# Altium project Hello-Farogh-V1I0.PrjPcb (part 1 of 3)
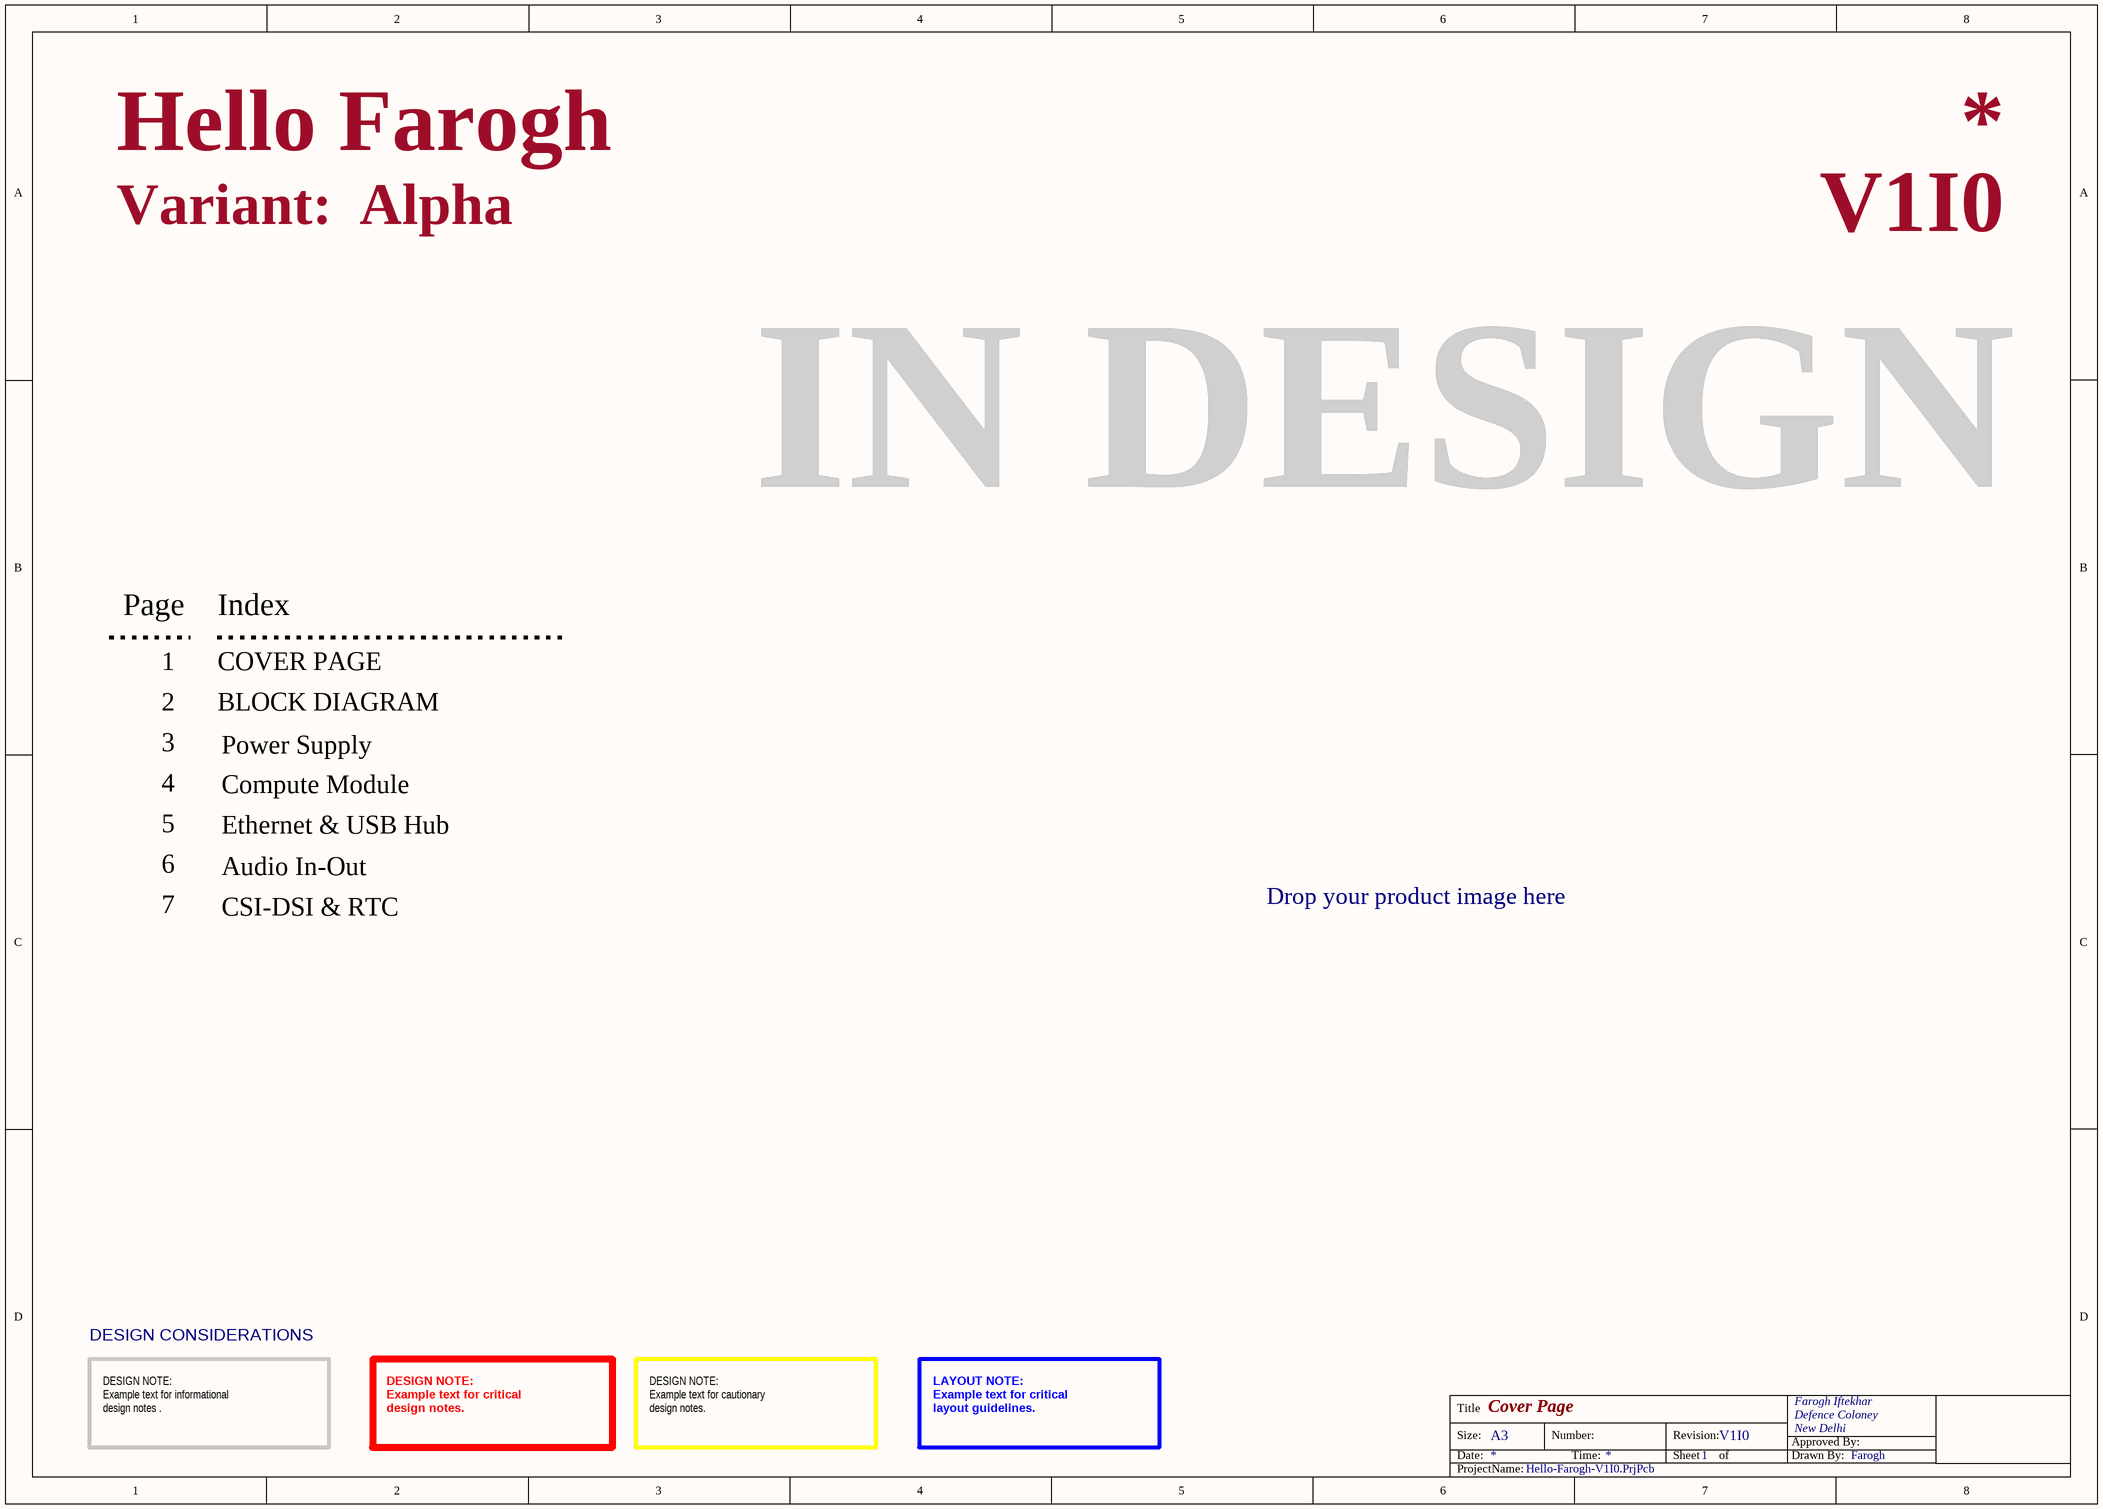
[diagram p0: [01] - Cover Page.SchDoc]
Project: Hello Farogh; Project Status 1: IN DESIGN; Project Status 2: REVIEW; Project Status 3: RELEASED; Variant: Alpha; Version: V1I0
7 sheets, 176 parts. Net scope: global (net labels, ports and power ports of the same name join across sheets).
Board file: Board.PcbDoc
Sheets:
  [01] - Cover Page.SchDoc
  [02] - Block Diagram.SchDoc
  [03] - Power Supply.SchDoc
  [04] - Compute Module.SchDoc
  [05] - Ethernet & USB Hub.SchDoc
  [06] - Audio In-Out.SchDoc
  [07] - CSI-DSI & RTC.SchDoc

## Sheet [01] - Cover Page.SchDoc: Cover Page
size A3; DrawnBy: Farogh; Organization: Farogh Iftekhar; Address1: Defence Coloney; Address2: New Delhi; Revision: V1I0; SheetNumber: 1

### Notes on the sheet
- Variant:
- Page
- Index
- 1
- 2
- COVER PAGE
- BLOCK DIAGRAM
- 3
- Power Supply
- 4
- 5
- Ethernet & USB Hub
- Compute Module
- 6
- 7
- CSI-DSI & RTC
- Audio In-Out
- Drop your product image here
- DESIGN CONSIDERATIONS
- DESIGN NOTE:
  Example text for informational
  design notes .
- DESIGN NOTE:
  Example text for critical
  design notes.
- DESIGN NOTE:
  Example text for cautionary
  design notes.
- LAYOUT NOTE:
  Example text for critical
  layout guidelines.
- Title
- Size:
- Date:
- A3
- Number:
- Time:
- Revision:
- Sheet
- of
- Approved By:
- Drawn By:
- ProjectName:

## Sheet [02] - Block Diagram.SchDoc: Block Diagram
size A3; DrawnBy: Farogh; Organization: Farogh Iftekhar; Address1: Defence Coloney; Address2: New Delhi; Revision: V1I0; SheetNumber: 2
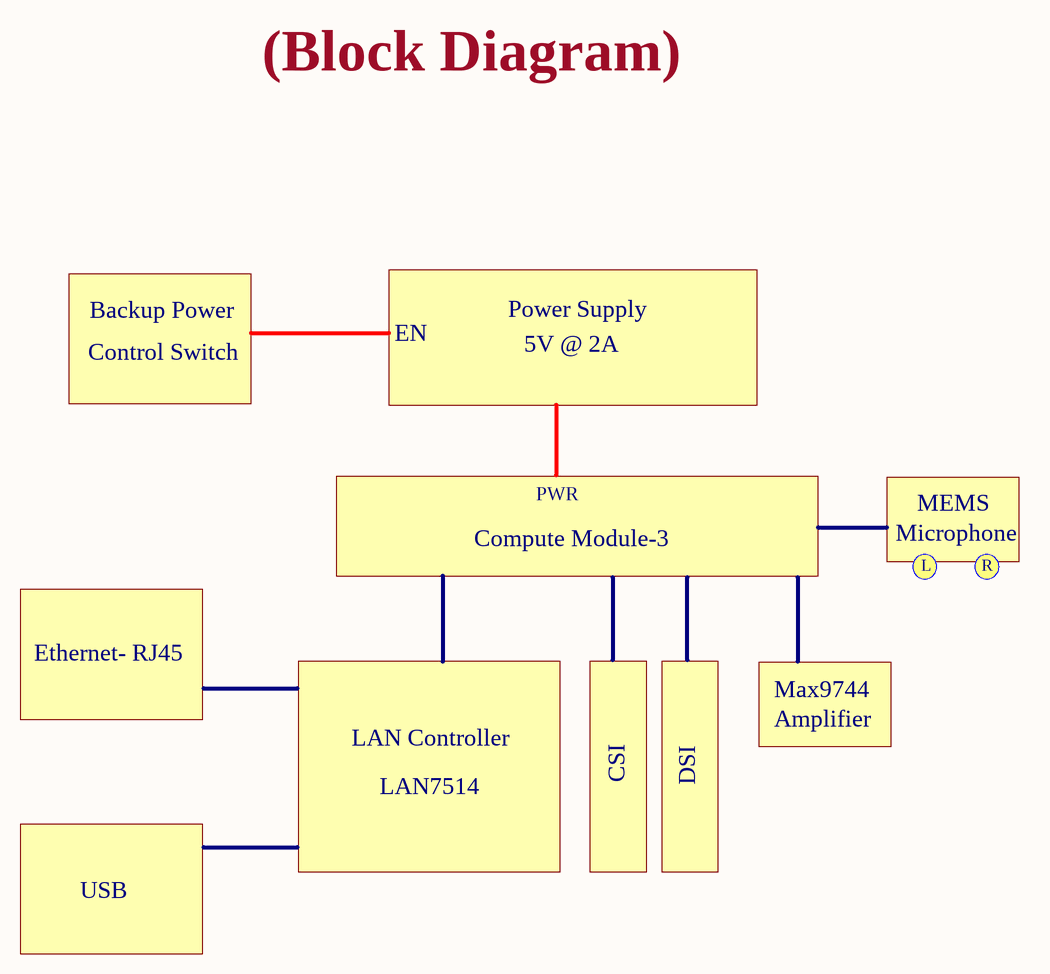
[diagram p1: [02] - Block Diagram.SchDoc]

### Notes on the sheet
- (Block Diagram)
- Backup Power
- Power Supply
- Control Switch
- EN
- 5V @ 2A
- PWR
- Microphone
- MEMS
- Compute Module-3
- L
- R
- Ethernet- RJ45
- Max9744
- Amplifier
- LAN Controller
- LAN7514
- CSI
- DSI
- USB
- Title
- Size:
- Date:
- A3
- Number:
- Time:
- Revision:
- Sheet
- of
- Approved By:
- Drawn By:
- ProjectName:

## Sheet [03] - Power Supply.SchDoc: Power Supply
size A3; DrawnBy: Farogh; Organization: Farogh Iftekhar; Address1: Defence Coloney; Address2: New Delhi; Revision: V1I0; SheetNumber: 3
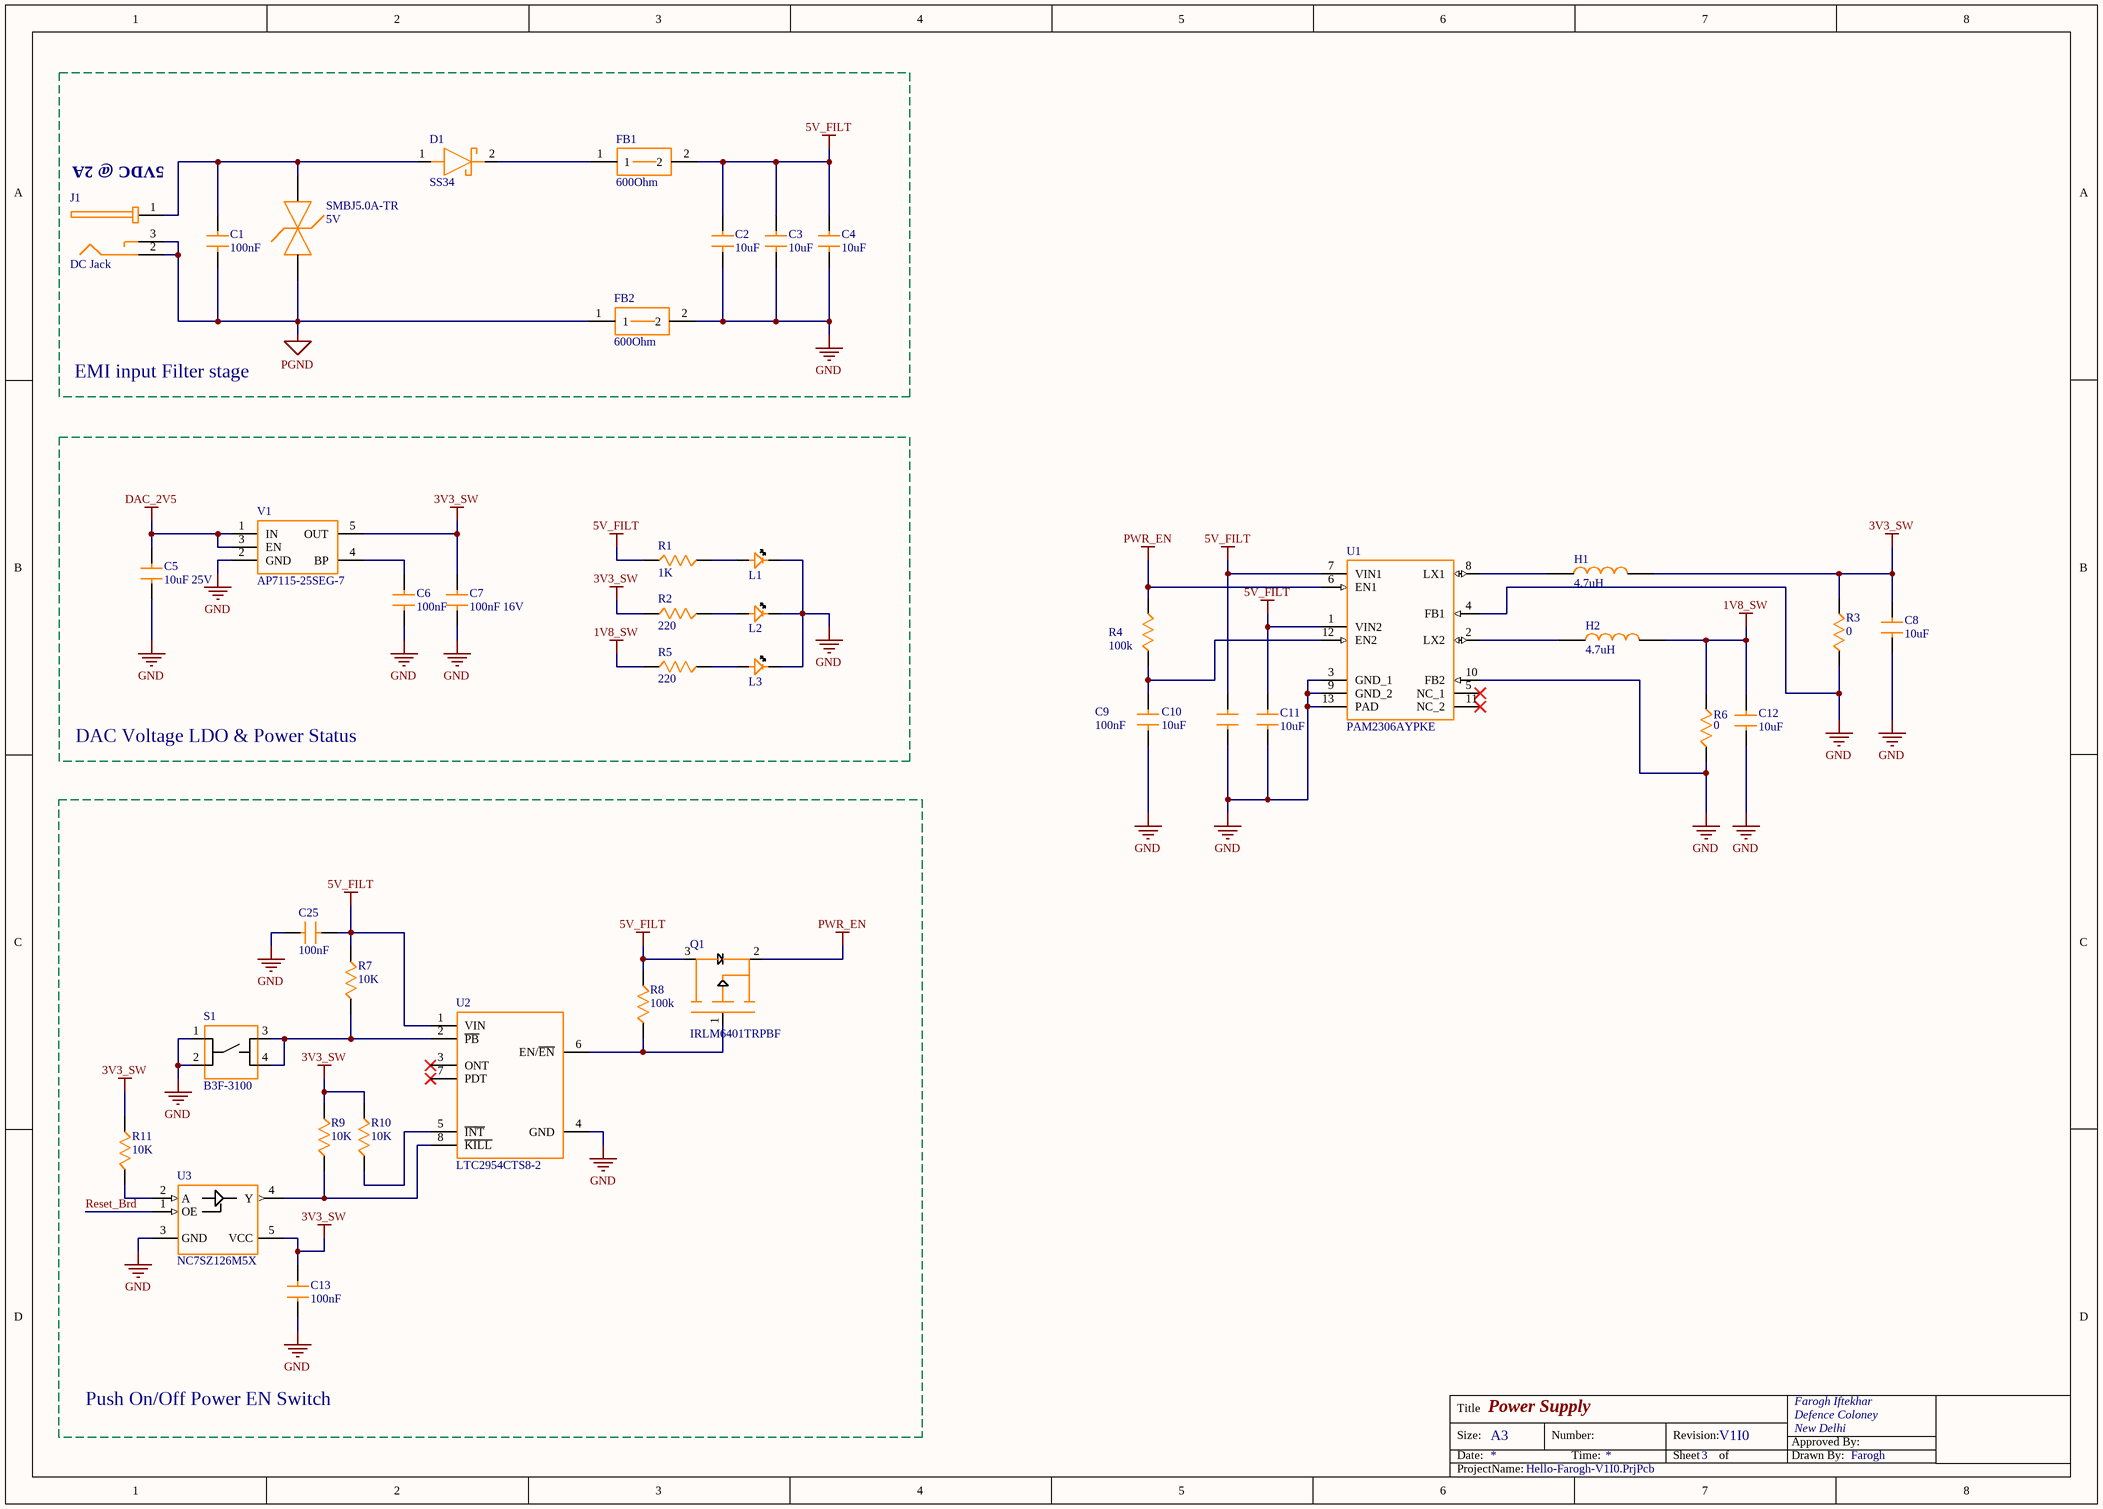
[diagram p2: [03] - Power Supply.SchDoc]

### Parts
C1  100nF  [C0805]
C2  10uF  [C1206]
C3  10uF  [C1206]
C4  10uF  [C1206]
C5  10uF 25V  [C0805]
C6  100nF  [C0805]
C7  100nF 16V  [C0805]
C8  10uF  [C0805]
C9  100nF  [C0805]
C10  10uF  [C0805]
C11  10uF  [C0805]
C12  10uF  [C0805]
C13  100nF  [C0805]
C25  100nF  [C0805]
D1  SS34  [SS34]
FB1  600Ohm  [FB_1210]
FB2  600Ohm  [FB_1210]
H1  4.7uH  [SRN4018]
H2  4.7uH  [SRN4018]
J1  DC Jack  [PJ-059BH]
L1  599-0130-007F  [LED0805]  (value not drawn)
L2  599-0130-007F  [LED0805]  (value not drawn)
L3  599-0130-007F  [LED0805]  (value not drawn)
Q1  IRLM6401TRPBF  [IRLML6401TRPBF]
R1  1K  [R0805]
R2  220  [R0805]
R3  0  [R0805]
R4  100k  [R0805]
R5  220  [R0805]
R6  0  [R0805]
R7  10K  [R0805]
R8  100k  [R0805]
R9  10K  [R0805]
R10  10K  [R0805]
R11  10K  [R0805]
S1  B3F-3100  [BSF-3100]
SMBJ5.0A-TR  5V  [SMBJ5.0A-TR]
U1  PAM2306AYPKE  [PAM2306AYPKE]
U2  LTC2954CTS8-2  [LTC2954CTS8-2]
U3  NC7SZ126M5X  [NC7SZ126M5X]
V1  AP7115-25SEG-7  [AP7115-25SEG-7]

### Blocks framed on the sheet
EMI input Filter stage: C1-C4 D1 FB1 FB2 J1 SMBJ5.0A-TR
DAC Voltage LDO & Power Status: C5-C7 L1-L3 R1 R2 R5 V1
Push On/Off Power EN Switch: C13 C25 Q1 R7-R11 S1 U2 U3

### Nets
1V8_SW: C12.2 H2.2 R5.1 R6.2
3V3_SW: C7.2 C8.2 C13.1 H1.2 R2.1 R3.2 R9.1 R10.2 R11.1 U3.5(VCC) V1.5(OUT)
5V_FILT: C2.2 C3.2 C4.2 C10.2 C11.2 C25.1 FB1.2 Q1.3(D) R1.1 R7.2 R8.2 U1.1(VIN2) U1.7(VIN1) U2.1(VIN)
DAC_2V5: C5.2 V1.1(IN) V1.3(EN)
GND: C2.1 C3.1 C4.1 C5.1 C6.1 C7.1 C8.1 C9.1 C10.1 C11.1 C12.1 C13.2 C25.2 FB2.2 L1.2 L2.2 L3.2 R3.1 R6.1 S1.1 S1.2 U1.3(GND_1) U1.4(FB1) U1.9(GND_2) U1.10(FB2) U1.13(PAD) U2.4(GND) U3.3(GND) V1.2(GND)
PGND: C1.1 FB2.1 J1.2 J1.3 SMBJ5.0A-TR.2(A)
PWR_EN: Q1.2(S) R4.2 U1.6(EN1)
Reset_Brd: U3.1(OE)
NetC1_2: C1.2 D1.1(A) J1.1 SMBJ5.0A-TR.1(K)
NetC6_2: C6.2 V1.4(BP)
NetC9_2: C9.2 R4.1 U1.12(EN2)
NetD1_2: D1.2(K) FB1.1
NetH1_1: H1.1 U1.8(LX1)
NetH2_1: H2.1 U1.2(LX2)
NetL1_1: L1.1 R1.2
NetL2_1: L2.1 R2.2
NetL3_1: L3.1 R5.2
NetQ1_1: Q1.1(G) R8.1 U2.6(EN/~{EN})
NetR7_1: R7.1 S1.3 S1.4 U2.2(~{PB})
NetR9_2: R9.2 U2.8(~{KILL}) U3.4(Y)
NetR10_1: R10.1 U2.5(~{INT})
NetR11_2: R11.2 U3.2(A)

Not connected (* = marked no-connect by the designer): U1 5(NC_1)* 11(NC_2)*; U2 3(ONT)* 7(PDT)*

### Notes on the sheet
- (near J1) 5VDC @ 2A
- Title
- Size:
- Date:
- A3
- Number:
- Time:
- Revision:
- Sheet
- of
- Approved By:
- Drawn By:
- ProjectName:

### Library data of the parts
C1 C6 C7 C9 C13 C25 = C_0805-100nF-16V: Multilayer Ceramic Capacitors MLCC - SMD/SMT 100nF 16V 20% Ceramic Capacitor; Manufacturer: Yageo; Manufacturer Part Number: CC0805MRX7R7BB104; Capacitance: 0.1 uF; Type: General Purpose and High Capacitance Surface Mount Ceramic Multilayer Capacitor; Voltage Rating DC: 16 VDC; Capacitance - pF: 100000 pF; Class: Class 2; Dielectric: X7R; Product Status: New at Mouser; Supplier 1: Mouser; Category: Multilayer Ceramic Capacitors MLCC - SMD/SMT; Stock 1: 15850; Pricing 1: 1=0.240, 10=0.114, 100=0.057, 1000=0.049, 4000=0.036, 8000=0.034, 24000=0.033, 48000=0.031, 100000=0.026 (USD); Height: 0.85 mm; Length: 2 mm; Package / Case: 0805 (2012 metric); Packaging: Cut Tape; Product: General Type MLCCs; Series: CC; Termination Style: SMD/SMT; Tolerance: 20 %; Width: 1.25 mm; Brand: Yageo; Capacitance - nF: 100 nF; Case Code - in: 0805; Case Code - mm: 2012; Maximum Operating Temperature: + 125 C; Minimum Operating Temperature: - 55 C; Product Type: Ceramic Capacitors; Standard Pack Qty: 4000; Subcategory: Capacitors; Termination: Standard; Minimum Order Quantity: 1; Reeling: True; ComponentLink1URL: https://www.mouser.com/datasheet/2/447/UPY-GPHC_X7R_6.3V-to-50V_18-1154002.pdf; ComponentLink1Description: https://www.mouser.com/datasheet/2/447/UPY-GPHC_X7R_6.3V-to-50V_18-1154002.pdf; Supplier Part Number 1: 603-CC0805MRX77BB104
C2-C4 = C_1206-10uF: Multilayer Ceramic Capacitors MLCC - SMD/SMT 10uF Y5V -20/+80% 50V; Manufacturer: Yageo; Manufacturer Part Number: CC1210ZKY5V9BB106; Tolerance: - 20 %, + 80 %; Type: MLCC Surface Mount Ceramic Capacitor; Voltage Rating DC: 50 VDC; Class: Class 2; Supplier 1: Mouser; RoHS: RoHS Compliant; Category: Multilayer Ceramic Capacitors MLCC - SMD/SMT; Stock 1: 4065; Pricing 1: 1=0.760, 10=0.524, 100=0.298, 500=0.287, 1000=0.279, 2000=0.270 (USD); Capacitance: 10 uF; Height: 1.5 mm; Length: 3.2 mm; Package / Case: 1210 (3225 metric); Packaging: Cut Tape; Product: General Type MLCCs; Series: CC; Termination Style: SMD/SMT; Width: 2.5 mm; Brand: Yageo; Case Code - in: 1210; Case Code - mm: 3225; Dielectric: Y5V; Maximum Operating Temperature: + 85 C; Minimum Operating Temperature: - 30 C; Product Type: Ceramic Capacitors; Standard Pack Qty: 2000; Subcategory: Capacitors; Termination: Standard; RoHS - Mouser: Y; Minimum Order Quantity: 1; Reeling: True; ComponentLink1URL: https://www.mouser.com/datasheet/2/447/UPY-GPHC_Y5V_6.3V-to-50V_8-1280790.pdf; ComponentLink1Description: https://www.mouser.com/datasheet/2/447/UPY-GPHC_Y5V_6.3V-to-50V_8-1280790.pdf; Supplier Part Number 1: 603-CC121ZKY5V9BB106
C5 C8 C10-C12 = C_0805-10uF: Multilayer Ceramic Capacitors MLCC - SMD/SMT 10uF 10% 25V; Manufacturer: Yageo; Manufacturer Part Number: CC0805KFX5R8BB106; Type: MLCC Surface Mount Ceramic Capacitor; Voltage Rating DC: 25 VDC; Class: Class 2; CNHTS: 8532241000; Dielectric: X5R; TARIC: 8532240000; Product Status: New Product; Supplier 1: Mouser; RoHS: RoHS Compliant; Category: Multilayer Ceramic Capacitors MLCC - SMD/SMT; Stock 1: 9112; Pricing 1: 1=0.550, 10=0.342, 100=0.175, 1000=0.158, 2500=0.110, 10000=0.106, 20000=0.103, 50000=0.096, 100000=0.089 (USD); Capacitance: 10 uF; Height: 1.25 mm; Length: 2 mm; Package / Case: 0805 (2012 metric); Packaging: Cut Tape; Product: General Type MLCCs; Series: CC; Termination Style: SMD/SMT; Tolerance: 10 %; Width: 1.25 mm; Brand: Yageo; Case Code - in: 0805; Case Code - mm: 2012; HTS Code: 8532240020; Maximum Operating Temperature: + 85 C; Minimum Operating Temperature: - 55 C; Product Type: Ceramic Capacitors; Standard Pack Qty: 10000; Subcategory: Capacitors; Termination: Standard; RoHS - Mouser: Y; Minimum Order Quantity: 1; Reeling: True; ComponentLink1URL: http://www.mouser.com/datasheet/2/447/UPY-GPHC_X5R_4V-to-50V_25-1131599.pdf; ComponentLink1Description: http://www.mouser.com/datasheet/2/447/UPY-GPHC_X5R_4V-to-50V_25-1131599.pdf; Supplier Part Number 1: 603-CC0805KFX5R8BB10
D1 = SS34: Schottky Diodes & Rectifiers 3a 40V Rectifier Schottky Barrier; Manufacturer: ON Semiconductor / Fairchild; Configuration: Single; Ifsm - Forward Surge Current: 100 A; Ir - Reverse Current: 500 uA; Vf - Forward Voltage: 0.5 V; Supplier 1: Mouser; Manufacturer Part Number: SS34; RoHS: RoHS Compliant; Category: Schottky Diodes & Rectifiers; Stock 1: 43909; Pricing 1: 1=0.610, 10=0.504, 100=0.307, 1000=0.238, 3000=0.203 (USD); Height: 2.45 mm (Max); Length: 7.15 mm (Max); Operating Temperature Range: - 55 C to + 150 C; Package / Case: SMC (DO-214AB); Packaging: Cut Tape; Product: Schottky Rectifiers; Series: SS34; Technology: Si; Type: Schottky Diode; Width: 6.25 mm (Max); Brand: ON Semiconductor / Fairchild; Mounting Style: SMD/SMT; If - Forward Current: 3 A; Maximum Operating Temperature: + 150 C; Minimum Operating Temperature: - 55 C; Product Type: Schottky Diodes & Rectifiers; Standard Pack Qty: 3000; Subcategory: Diodes & Rectifiers; Vrrm - Repetitive Reverse Voltage: 40 V; RoHS - Mouser: Y; Minimum Order Quantity: 1; Reeling: True; ComponentLink1URL: https://www.mouser.com/datasheet/2/308/SS34-1307214.pdf; ComponentLink1Description: https://www.mouser.com/datasheet/2/308/SS34-1307214.pdf; Supplier Part Number 1: 512-SS34
FB1 FB2 = FB_1210-600, 3000mA: Ferrite Beads HI CUR CHIP BD 1210 600OHMS 30%; Manufacturer: Taiyo Yuden; Manufacturer Part Number: FBMH3225HM601NT; Maximum DC Current: 3 A; Maximum DC Resistance: 42 mOhms; Type: Chip Bead Inductor for Power Lines; Test Frequency: 100 MHz; Supplier 1: Mouser; RoHS: RoHS Compliant; Category: Ferrite Beads; Stock 1: 19251; Pricing 1: 1=0.280, 10=0.178, 100=0.158, 250=0.142, 500=0.130, 1000=0.100, 2000=0.097, 5000=0.093, 10000=0.090 (USD); Capacitance: -; Height: 2.5 mm; Impedance: 600 Ohms; Length: 3.2 mm; Operating Temperature Range: - 40 C to + 125 C; Package / Case: 1210 (3225 metric); Packaging: Cut Tape; Product: Ferrite Chip Beads; Series: FB; Termination Style: SMD/SMT; Tolerance: 30 %; Width: 2.5 mm; Brand: Taiyo Yuden; Maximum Operating Temperature: + 125 C; Minimum Operating Temperature: - 40 C; Product Type: Ferrite Beads; Standard Pack Qty: 1000; Subcategory: Ferrites; RoHS - Mouser: Y; Minimum Order Quantity: 1; Reeling: True; ComponentLink1URL: https://www.mouser.com/datasheet/2/396/TaiyoYuden_chipbeads01_e-1274227.pdf; ComponentLink1Description: https://www.mouser.com/datasheet/2/396/TaiyoYuden_chipbeads01_e-1274227.pdf; Supplier Part Number 1: 963-FBMH3225HM601NT
H1 H2 = SRN4018-4R7M: Fixed Inductors 4.7uH 20% SMD 4018; Manufacturer: Bourns; Core Material: Ferrite; Maximum DC Current: 1.9 A; Maximum DC Resistance: 84 mOhms; Shielding: Shielded; CNHTS: 8504500000; MXHTS: 85045002; TARIC: 8504509590; Test Frequency: 100 kHz; Supplier 1: Mouser; Manufacturer Part Number: SRN4018-4R7M; RoHS: RoHS Compliant; Category: Fixed Inductors; Stock 1: 24604; Pricing 1: 1=0.360, 10=0.246, 100=0.224, 250=0.210, 500=0.188, 1000=0.152, 3000=0.133, 6000=0.132, 9000=0.131 (USD); Application: Power; Height: 1.8 mm; Inductance: 4.7 uH; Length: 4 mm; Packaging: Cut Tape; Product: Fixed Inductors; Series: SRN4018; Termination Style: SMD/SMT; Tolerance: 20 %; Width: 4 mm; Brand: Bourns; Mounting Style: PCB Mount; HTS Code: 8504508000; Maximum Operating Temperature: + 120 C; Minimum Operating Temperature: - 25 C; Product Type: Fixed Inductors; Standard Pack Qty: 3000; Subcategory: Inductors, Chokes & Coils; Termination: -; RoHS - Mouser: Y; Minimum Order Quantity: 1; Reeling: True; ComponentLink1URL: http://www.mouser.com/datasheet/2/54/rn4018-1391320.pdf; ComponentLink1Description: http://www.mouser.com/datasheet/2/54/rn4018-1391320.pdf; Supplier Part Number 1: 652-SRN4018-4R7M
J1 = DC-PJ-059BH: DC Power Connectors power jack, 2.5 x 5.5 mm, horizontal, through hole, high current, 1 switch; Manufacturer: CUI; Current Rating: 5 A; Inside Contact Diameter: 2.5 mm; Mounting Angle: Right Angle; Outside Contact Diameter: 5.7 mm; Voltage Rating: 24 V; Insulation Resistance: 100 MOhms; Supplier 1: Mouser; Manufacturer Part Number: PJ-059BH; RoHS: RoHS Compliant; Category: DC Power Connectors; Stock 1: 122; Pricing 1: 1=0.890, 10=0.785, 25=0.739, 50=0.708, 100=0.677, 250=0.616, 500=0.554, 1000=0.492, 2500=0.446 (USD); Color: Black; Connector Type: Jack; Contact Plating: Nickel; Housing Material: Polybutylene Terephthalate (PBT); Packaging: Tray; Product: Jacks; Termination Style: Through Hole; Brand: CUI; Contact Material: Copper; Flammability Rating: UL 94 V-0; Mounting Style: Panel; Contact Gender: Pin (Male); Maximum Operating Temperature: + 85 C; Minimum Operating Temperature: - 25 C; Product Type: DC Power Connectors; Standard Pack Qty: 280; Subcategory: Power Connectors; RoHS - Mouser: Y; Minimum Order Quantity: 1; Reeling: False; ComponentLink1URL: https://www.mouser.com/datasheet/2/670/pj-059bh-1312730.pdf; ComponentLink1Description: https://www.mouser.com/datasheet/2/670/pj-059bh-1312730.pdf
L1-L3 = 599-0130-007F: Standard LEDs - SMD SMD 0805 ORANGE; Manufacturer: Dialight; Lens Color/Style: Clear; Luminous Intensity: 95 mcd; Viewing Angle: 140 deg; CNHTS: 8541401000; If - Forward Current: 20 mA; Vf - Forward Voltage: 2.1 V; Wavelength/Color Temperature: 605 nm; Product Status: New Product; Supplier 1: Mouser; Manufacturer Part Number: 599-0130-007F; RoHS: RoHS Compliant; Category: Standard LEDs - SMD; Stock 1: 15445; Pricing 1: 1=0.450, 10=0.264, 100=0.106, 1000=0.083, 2500=0.060, 4000=0.060, 8000=0.053, 24000=0.050 (USD); Height: 0.7 mm; Illumination Color: Orange; Length: 2 mm; Orientation: Top View; Package / Case: 0805 (2012 metric); Packaging: Cut Tape; Product: Orange LEDs; Width: 1.25 mm; Brand: Dialight; Mounting Style: SMD/SMT; HTS Code: 8541402000; Maximum Operating Temperature: + 100 C; Minimum Operating Temperature: - 40 C; Product Type: LED - Standard; Standard Pack Qty: 4000; Subcategory: LEDs; RoHS - Mouser: Y; Minimum Order Quantity: 1; Reeling: True; ComponentLink1URL: http://www.mouser.com/datasheet/2/109/Dialight_CBI_data_599-0805_Apr2018-1370606.pdf; ComponentLink1Description: http://www.mouser.com/datasheet/2/109/Dialight_CBI_data_599-0805_Apr2018-1370606.pdf; Supplier Part Number 1: 645-599-0130-007F
Q1 = IRLML6401TRPBF: MOSFET MOSFT P-Ch -4.3A 50mOhm 10nC Log Lvl; Manufacturer: Infineon Technologies; Configuration: Single; Transistor Type: 1 P-Channel; Number of Channels: 1 Channel; Transistor Polarity: P-Channel; Id - Continuous Drain Current: 4.3 A; Pd - Power Dissipation: 1.3 W; Rds On - Drain-Source Resistance: 50 mOhms; Vds - Drain-Source Breakdown Voltage: 12 V; Vgs - Gate-Source Voltage: 8 V; Supplier 1: Mouser; Manufacturer Part Number: IRLML6401TRPBF; RoHS: RoHS Compliant; Category: MOSFET; Stock 1: 70377; Pricing 1: 1=0.420, 10=0.327, 100=0.178, 1000=0.133, 3000=0.115, 9000=0.108 (USD); Height: 1.1 mm; Length: 2.9 mm; Package / Case: SOT-23-3; Packaging: Cut Tape; Technology: Si; Width: 1.3 mm; Brand: Infineon Technologies; Mounting Style: SMD/SMT; Product Type: MOSFET; Qg - Gate Charge: 10 nC; Standard Pack Qty: 3000; Subcategory: MOSFETs; RoHS - Mouser: Y; Minimum Order Quantity: 1; Reeling: True; ComponentLink1URL: https://www.mouser.com/datasheet/2/196/irlml6401pbf-1228277.pdf; ComponentLink1Description: https://www.mouser.com/datasheet/2/196/irlml6401pbf-1228277.pdf; Supplier Part Number 1: 942-IRLML6401TRPBF
R1 = R_0805-1K: Thin Film Resistors - SMD 1K ohm 1% 50 ppm Thin Film; Manufacturer: Yageo; Manufacturer Part Number: RT0805FRE101KL; Power Rating: 125 mW (1/8 W); Resistance: 1 kOhms; Temperature Coefficient: 50 PPM / C; Voltage Rating: 150 V; CNHTS: 8533211000; MXHTS: 85332101; TARIC: 8533210000; Product Status: New Product; Supplier 1: Mouser; RoHS: RoHS Compliant; Category: Thin Film Resistors - SMD; Stock 1: 18694; Pricing 1: 1=0.120, 10=0.064, 100=0.023, 1000=0.016, 2500=0.011, 10000=0.010, 50000=0.009 (USD); Features: -; Height: 0.5 mm; Length: 2 mm; Package / Case: 0805 (2012 metric); Packaging: Cut Tape; Product: Precision Resistors Thin Film SMD; Series: RT; Termination Style: SMD/SMT; Tolerance: 1 %; Type: High Stability Thin Film Chip Resistor; Width: 1.25 mm; Brand: Yageo; Case Code - in: 0805; Case Code - mm: 2012; HTS Code: 8533210030; Maximum Operating Temperature: + 155 C; Minimum Operating Temperature: - 55 C; Standard Pack Qty: 10000; RoHS - Mouser: Y; Minimum Order Quantity: 1; Reeling: True; ComponentLink1URL: http://www.mouser.com/datasheet/2/447/PYu-RT_1-to-0.01_RoHS_L_9-1222720.pdf; ComponentLink1Description: http://www.mouser.com/datasheet/2/447/PYu-RT_1-to-0.01_RoHS_L_9-1222720.pdf; Supplier Part Number 1: 603-RT0805FRE101KL
R2 R5 = R_0805-220: Thin Film Resistors - SMD; Manufacturer: Yageo; Manufacturer Part Number: RT0805DRE07220RL; Power Rating: 125 mW (1/8 W); Resistance: 220 Ohms; Temperature Coefficient: 50 PPM / C; Tolerance: 0.5 %; Voltage Rating: 150 V; CNHTS: 8533211000; MXHTS: 85332101; TARIC: 8533210000; Supplier 1: Mouser; RoHS: RoHS Compliant; Category: Thin Film Resistors - SMD; Stock 1: 14351; Pricing 1: 1=0.170, 10=0.088, 100=0.031, 1000=0.022, 5000=0.015, 10000=0.014, 25000=0.013, 50000=0.012 (USD); Features: -; Height: 0.5 mm; Length: 2 mm; Operating Temperature Range: - 55 C to + 125 C; Packaging: Cut Tape; Product: Thin Film Resistors SMD; Series: RT; Technology: Thin Film; Termination Style: SMD/SMT; Type: High Precision, High Stability; Width: 1.2 mm; Brand: Yageo; Mounting Style: PCB Mount; Case Code - in: 0805; Case Code - mm: 2012; HTS Code: 8533210030; Maximum Operating Temperature: + 125 C; Minimum Operating Temperature: - 55 C; Product Type: Thin Film Resistors; Standard Pack Qty: 5000; Subcategory: Resistors; RoHS - Mouser: Y; Minimum Order Quantity: 1; Reeling: True; ComponentLink1URL: https://www.mouser.com/datasheet/2/447/PYu-RT_1-to-0.01_RoHS_L_9-1222720.pdf; ComponentLink1Description: https://www.mouser.com/datasheet/2/447/PYu-RT_1-to-0.01_RoHS_L_9-1222720.pdf; Supplier Part Number 1: 603-RT0805DRE07220RL
R3 R6 = R_0805-0: Current Sense Resistors - SMD 0 ohm Jumper 1/2W; Manufacturer: Yageo; Manufacturer Part Number: PA0805-R-470RL; Power Rating: 500 mW (1/2 W); Resistance: 0 Ohms; CNHTS: 8533211000; TARIC: 8533210000; Product Status: New Product; Supplier 1: Mouser; RoHS: RoHS Compliant; Category: Current Sense Resistors - SMD; Stock 1: 3927; Pricing 1: 1=1.30, 10=1.06, 100=0.706, 500=0.595, 1000=0.495, 5000=0.431, 10000=0.421, 25000=0.409 (USD); Application: Current Sense; Length: 2.03 mm; Packaging: Cut Tape; Product: Current Sense Chip Resistor Surface Mount; Series: PA_L; Technology: Metal Element; Termination Style: SMD/SMT; Tolerance: -; Type: Low TCR Current Sense Resistor; Width: 1.27 mm; Brand: Yageo; Mounting Style: PCB Mount; Case Code - in: 0805; Case Code - mm: 2012; HTS Code: 8533210030; Maximum Operating Temperature: + 155 C; Minimum Operating Temperature: - 55 C; Product Type: Current Sense Resistors; Standard Pack Qty: 5000; Subcategory: Resistors; Termination: 2 Terminal; RoHS - Mouser: Y; Minimum Order Quantity: 1; Reeling: True; ComponentLink1URL: http://www.mouser.com/datasheet/2/447/PYu-PA0805_L_51_RoHS_0-1480254.pdf; ComponentLink1Description: http://www.mouser.com/datasheet/2/447/PYu-PA0805_L_51_RoHS_0-1480254.pdf; Supplier Part Number 1: 603-PA0805-R-470RL
R4 R8 = R_0805-100K: Thick Film Resistors - SMD 100K ohm 1% 150V AEC-Q200; Manufacturer: Yageo; Manufacturer Part Number: AC0805FR-13100KL; Power Rating: 125 mW (1/8 W); Resistance: 100 kOhms; Temperature Coefficient: 100 PPM / C; Product Status: New Product; Supplier 1: Mouser; Category: Thick Film Resistors - SMD; Stock 1: 38013; Pricing 1: 1=0.160, 10=0.037, 100=0.013, 1000=0.010, 2500=0.006, 20000=0.005 (USD); Application: Automotive Grade; Features: -; Height: 0.5 mm; Length: 2 mm; Package / Case: 0805 (2012 metric); Packaging: Cut Tape; Product: Thick Film Resistors SMD; Series: AC; Technology: Thick Film; Termination Style: SMD/SMT; Tolerance: 1 %; Voltage Rating: 150 V; Width: 1.25 mm; Brand: Yageo; Mounting Style: PCB Mount; Case Code - in: 0805; Case Code - mm: 2012; HTS Code: 8533210030; Maximum Operating Temperature: + 155 C; Minimum Operating Temperature: - 55 C; Product Type: Thick Film Resistors; Standard Pack Qty: 20000; Subcategory: Resistors; Minimum Order Quantity: 1; Reeling: True; ComponentLink1URL: http://www.mouser.com/datasheet/2/447/PYu-AC_51_RoHS_L_6-1152827.pdf; ComponentLink1Description: http://www.mouser.com/datasheet/2/447/PYu-AC_51_RoHS_L_6-1152827.pdf; Supplier Part Number 1: 603-AC0805FR-13100KL
R7 R9-R11 = R_0805-10K: Thick Film Resistors - SMD 10K   OHM   1% 1/4W; Manufacturer: Yageo; Manufacturer Part Number: RC0805FR-7W10KL; Power Rating: 125 mW, 250 mW; Resistance: 10 kOhms; Temperature Coefficient: 100 PPM / C; Voltage Rating: 150 V; CNHTS: 8533211000; MXHTS: 85332101; TARIC: 8533210000; Supplier 1: Mouser; RoHS: RoHS Compliant; Category: Thick Film Resistors - SMD; Stock 1: 8240; Pricing 1: 1=0.190, 10=0.115, 100=0.038, 1000=0.026, 5000=0.020, 10000=0.019, 25000=0.018, 100000=0.017 (USD); Application: High Reliability; Features: -; Height: 0.5 mm; Length: 2 mm; Package / Case: 0805 (2012 metric); Packaging: Cut Tape; Product: Thick Film Resistors SMD; Series: RC; Technology: Thick Film; Termination Style: SMD/SMT; Tolerance: 1 %; Type: High Power; Width: 1.25 mm; Brand: Yageo; Mounting Style: PCB Mount; Case Code - in: 0805; Case Code - mm: 2012; HTS Code: 8533210030; Maximum Operating Temperature: + 155 C; Minimum Operating Temperature: - 55 C; Product Type: Thick Film Resistors; Standard Pack Qty: 5000; Subcategory: Resistors; RoHS - Mouser: Y; Minimum Order Quantity: 1; Reeling: True; ComponentLink1URL: http://www.mouser.com/datasheet/2/447/yageo_01152019_DESIGN_KITS_8_2012-1522572.pdf; ComponentLink1Description: http://www.mouser.com/datasheet/2/447/yageo_01152019_DESIGN_KITS_8_2012-1522572.pdf; Supplier Part Number 1: 603-RC0805FR-7W10KL
S1 = B3F-3100: Tactile Switches 3.15mm VERT 100gF; Manufacturer: Omron Electronics; Actuator: Round; Contact Form: SPST; Current Rating: 50 mA; Operating Force: 1 N; Voltage Rating DC: 24 VDC; Ground Terminal: Yes; Illuminated: Non-Illuminated; Mounting Direction: Right Angle; CNHTS: 8536500000; MXHTS: 85365099; Supplier 1: Mouser; Manufacturer Part Number: B3F-3100; RoHS: RoHS Compliant; Category: Tactile Switches; Stock 1: 5962; Pricing 1: 1=0.470, 10=0.452, 25=0.444, 50=0.427, 100=0.369, 250=0.335, 500=0.319, 1000=0.252, 2500=0.235 (USD); Color: Gray; Contact Plating: Gold; Height: 7.4 mm; Illumination Color: -; Length: 6.25 mm; Series: B3F; Stem Height: 3.15 mm; Termination Style: Solder Pin; Voltage Rating AC: -; Width: 7.3 mm; Brand: Omron Electronics; Lamp Type: -; Mounting Style: Through Hole; HTS Code: 8536509065; Maximum Operating Temperature: + 70 C; Minimum Operating Temperature: - 25 C; Product Type: Tactile Switches; Standard Pack Qty: 1000; Subcategory: Switches; RoHS - Mouser: Y; Minimum Order Quantity: 1; Reeling: False; ComponentLink1URL: http://www.mouser.com/datasheet/2/307/en-b3f-13826.pdf; ComponentLink1Description: http://www.mouser.com/datasheet/2/307/en-b3f-13826.pdf; Supplier Part Number 1: 653-B3F-3100
SMBJ5.0A-TR = SMBJ5.0A-TR: ESD Suppressors / TVS Diodes 600W 5.0V Unidirect; Manufacturer: STMicroelectronics; Breakdown Voltage: 6.4 V to 7.07 V; Clamping Voltage: 13.4 V; Polarity: Unidirectional; Supplier 1: Mouser; Manufacturer Part Number: SMBJ5.0A-TR; RoHS: RoHS Compliant; Category: ESD Suppressors / TVS Diodes; Stock 1: 38599; Pricing 1: 1=0.360, 10=0.268, 100=0.146, 1000=0.109, 2500=0.094, 10000=0.088, 25000=0.081, 50000=0.078, 100000=0.075 (USD); Package / Case: DO-214AA-2 (SMB); Packaging: Cut Tape; Series: SMBJ; Termination Style: SMD/SMT; Brand: STMicroelectronics; Maximum Operating Temperature: + 175 C; Minimum Operating Temperature: - 65 C; Pd - Power Dissipation: 600 W; Product Type: TVS Diodes; Standard Pack Qty: 2500; Subcategory: TVS Diodes / ESD Suppression Diodes; Tradename: Transil; Vesd - Voltage ESD Air Gap: -; Vesd - Voltage ESD Contact: -; Working Voltage: 5 V; RoHS - Mouser: Y; Minimum Order Quantity: 1; Reeling: True; ComponentLink1URL: https://www.mouser.com/datasheet/2/389/smbj-955195.pdf; ComponentLink1Description: https://www.mouser.com/datasheet/2/389/smbj-955195.pdf; Supplier Part Number 1: 511-SMBJ5.0A
U1 = PAM2306AYPKE: Switching Voltage Regulators Dual PWM Step-Down 40uA 1A 1.5MHz; Manufacturer: Diodes Incorporated; Input Voltage: 2.5 V to 5.5 V; Input Voltage MAX: 5.5 V; Number of Outputs: 2 Output; Output Voltage: 1.8 V, 3.3 V; Topology: Buck; Input Voltage MIN: 2.5 V; Load Regulation: 0.5 %; Supplier 1: Mouser; Manufacturer Part Number: PAM2306AYPKE; RoHS: RoHS Compliant; Category: Switching Voltage Regulators; Stock 1: 14729; Pricing 1: 1=0.700, 10=0.589, 100=0.380, 1000=0.304, 3000=0.304 (USD); Operating Temperature Range: - 40 C to + 85 C; Output Current: 1 A; Package / Case: WDFN-EP-12; Packaging: Cut Tape; Series: PAM2306; Type: PWM Step-Down DC-DC Converter; Brand: Diodes Incorporated; Mounting Style: SMD/SMT; Shutdown: Shutdown; Switching Frequency: 1.5 MHz; Maximum Operating Temperature: + 85 C; Minimum Operating Temperature: - 40 C; Operating Supply Current: 40 uA; Product Type: Switching Voltage Regulators; Standard Pack Qty: 3000; Subcategory: PMIC - Power Management ICs; Supply Voltage - Min: 2.5 V; Tradename: PAM2306; RoHS - Mouser: Y; Minimum Order Quantity: 1; Reeling: True; ComponentLink1URL: https://www.mouser.com/datasheet/2/115/PAM2306-336770.pdf; ComponentLink1Description: https://www.mouser.com/datasheet/2/115/PAM2306-336770.pdf; Supplier Part Number 1: 621-PAM2306AYPKE
U2 = LTC2954CTS8-2: Supervisory Circuits Push Button On/Off Controller with U Interrupt for Menu Driven Applications; Manufacturer: Analog Devices; Manufacturer Part Number: LTC2954CTS8-2#TRMPBF; Output Type: Open Drain; Quiescent Current: 6 uA; Battery Backup Switching: No Backup; Chip Enable Signals: Chip Enable; Development Kit: DC1090A; Number of Inputs Monitored: 1 Input; Operating Supply Current: 0.006 mA; Power Fail Detection: Yes; Reset Delay Time: 43.5 ms; Supply Voltage - Max: 26.4 V; Supply Voltage - Min: 2.7 V; Threshold Voltage: 600 mV; Watchdog Timers: No Watchdog; Product Status: New at Mouser; Supplier 1: Mouser; RoHS: RoHS Compliant; Category: Supervisory Circuits; Stock 1: 998; Pricing 1: 1=4.56, 25=3.03, 100=2.50, 250=2.37, 500=2.17, 1500=2.11 (USD); Package / Case: SOT-8; Packaging: Cut Tape; Series: LTC2954; Type: Voltage Supervisory; Brand: Analog Devices; Manual Reset: Manual Reset; Mounting Style: SMD/SMT; Maximum Operating Temperature: + 70 C; Minimum Operating Temperature: 0 C; Product Type: Supervisory Circuits; Standard Pack Qty: 500; Subcategory: PMIC - Power Management ICs; RoHS - Mouser: Y; Minimum Order Quantity: 1; Reeling: True; ComponentLink1URL: https://www.mouser.com/datasheet/2/609/2954fb-1267553.pdf; ComponentLink1Description: https://www.mouser.com/datasheet/2/609/2954fb-1267553.pdf; Supplier Part Number 1: 584-C2954CTS8-2TMPF
U3 = NC7SZ126M5X: Buffers & Line Drivers UHS Buffer; Manufacturer: ON Semiconductor / Fairchild; Function: Buffer/Line Driver; Output Type: 3-State; Quiescent Current: 2 uA; Logic Family: TinyLogic UHS; Logic Type: CMOS; Number of Channels: 1 Channel; Number of Input Lines: 1 Input; Number of Output Lines: 1 Output; High Level Output Current: - 32 mA; Input Signal Type: Single-Ended; Low Level Output Current: 32 mA; Operating Supply Voltage: 1.65 V to 5.5 V; Pd - Power Dissipation: 200 mW; Polarity: Non-Inverting; Propagation Delay Time: 5.7 ns at 3.3 V, 5 ns at 5 V; Supply Voltage - Max: 5.5 V; Supply Voltage - Min: 1.65 V; Supplier 1: Mouser; Manufacturer Part Number: NC7SZ126M5X; RoHS: RoHS Compliant; Category: Buffers & Line Drivers; Stock 1: 19641; Pricing 1: 1=0.490, 10=0.314, 100=0.135, 1000=0.104, 3000=0.079, 9000=0.070, 24000=0.066 (USD); Height: 1.3 mm (Max); Length: 3 mm (Max); Package / Case: SOT-23-5; Packaging: Cut Tape; Series: NC7SZ126; Technology: CMOS; Width: 1.7 mm (Max); Brand: ON Semiconductor / Fairchild; Mounting Style: SMD/SMT; Supply Current - Max: 2 uA; Maximum Operating Temperature: + 85 C; Minimum Operating Temperature: - 40 C; Product Type: Buffers & Line Drivers; Standard Pack Qty: 3000; Subcategory: Logic ICs; Tradename: TinyLogic; RoHS - Mouser: Y; Minimum Order Quantity: 1; Reeling: True; ComponentLink1URL: https://www.mouser.com/datasheet/2/308/NC7SZ126-1301534.pdf; ComponentLink1Description: https://www.mouser.com/datasheet/2/308/NC7SZ126-1301534.pdf; Supplier Part Number 1: 512-NC7SZ126M5X
V1 = AP7115-25SEG-7: LDO Voltage Regulators LDO SNGLE OUTPUT 150MA 220MV 2.5-5.5V; Manufacturer: Diodes Incorporated; Input Voltage MAX: 5.5 V; Number of Outputs: 1 Output; Output Type: Fixed; Output Voltage: 2.5 V; Dropout Voltage - Max: 200 mV; PSRR / Ripple Rejection - Typ: 70 dB; Voltage Regulation Accuracy: 2 %; Ib - Input Bias Current: 80 uA; Line Regulation: 0.1 %/V; Load Regulation: 0.003 %/mA; Pd - Power Dissipation: 500 mW (1/2 W); Supplier 1: Mouser; Manufacturer Part Number: AP7115-25SEG-7; RoHS: RoHS Compliant; Category: LDO Voltage Regulators; Stock 1: 7418; Pricing 1: 1=0.380, 10=0.288, 100=0.156, 1000=0.117, 3000=0.101, 9000=0.095 (USD); Height: 1.1 mm; Length: 3 mm; Operating Temperature Range: - 40 C to + 85 C; Output Current: 150 mA; Package / Case: SOT-353-5; Packaging: Cut Tape; Product: LDO Regulators; Series: AP7115; Width: 1.6 mm; Brand: Diodes Incorporated; Mounting Style: SMD/SMT; Input Voltage MIN: 2.5 V; Maximum Operating Temperature: + 85 C; Minimum Operating Temperature: - 40 C; Product Type: LDO Voltage Regulators; Standard Pack Qty: 3000; Subcategory: PMIC - Power Management ICs; RoHS - Mouser: Y; Minimum Order Quantity: 1; Reeling: True; ComponentLink1URL: https://www.mouser.com/datasheet/2/115/AP7115-69794.pdf; ComponentLink1Description: https://www.mouser.com/datasheet/2/115/AP7115-69794.pdf; Supplier Part Number 1: 621-AP7115-25SEG-7

## Sheet [04] - Compute Module.SchDoc: Compte Module & SD Card
size A3; DrawnBy: Farogh; Organization: Farogh Iftekhar; Address1: Defence Coloney; Address2: New Delhi; Revision: V1I0; SheetNumber: 4
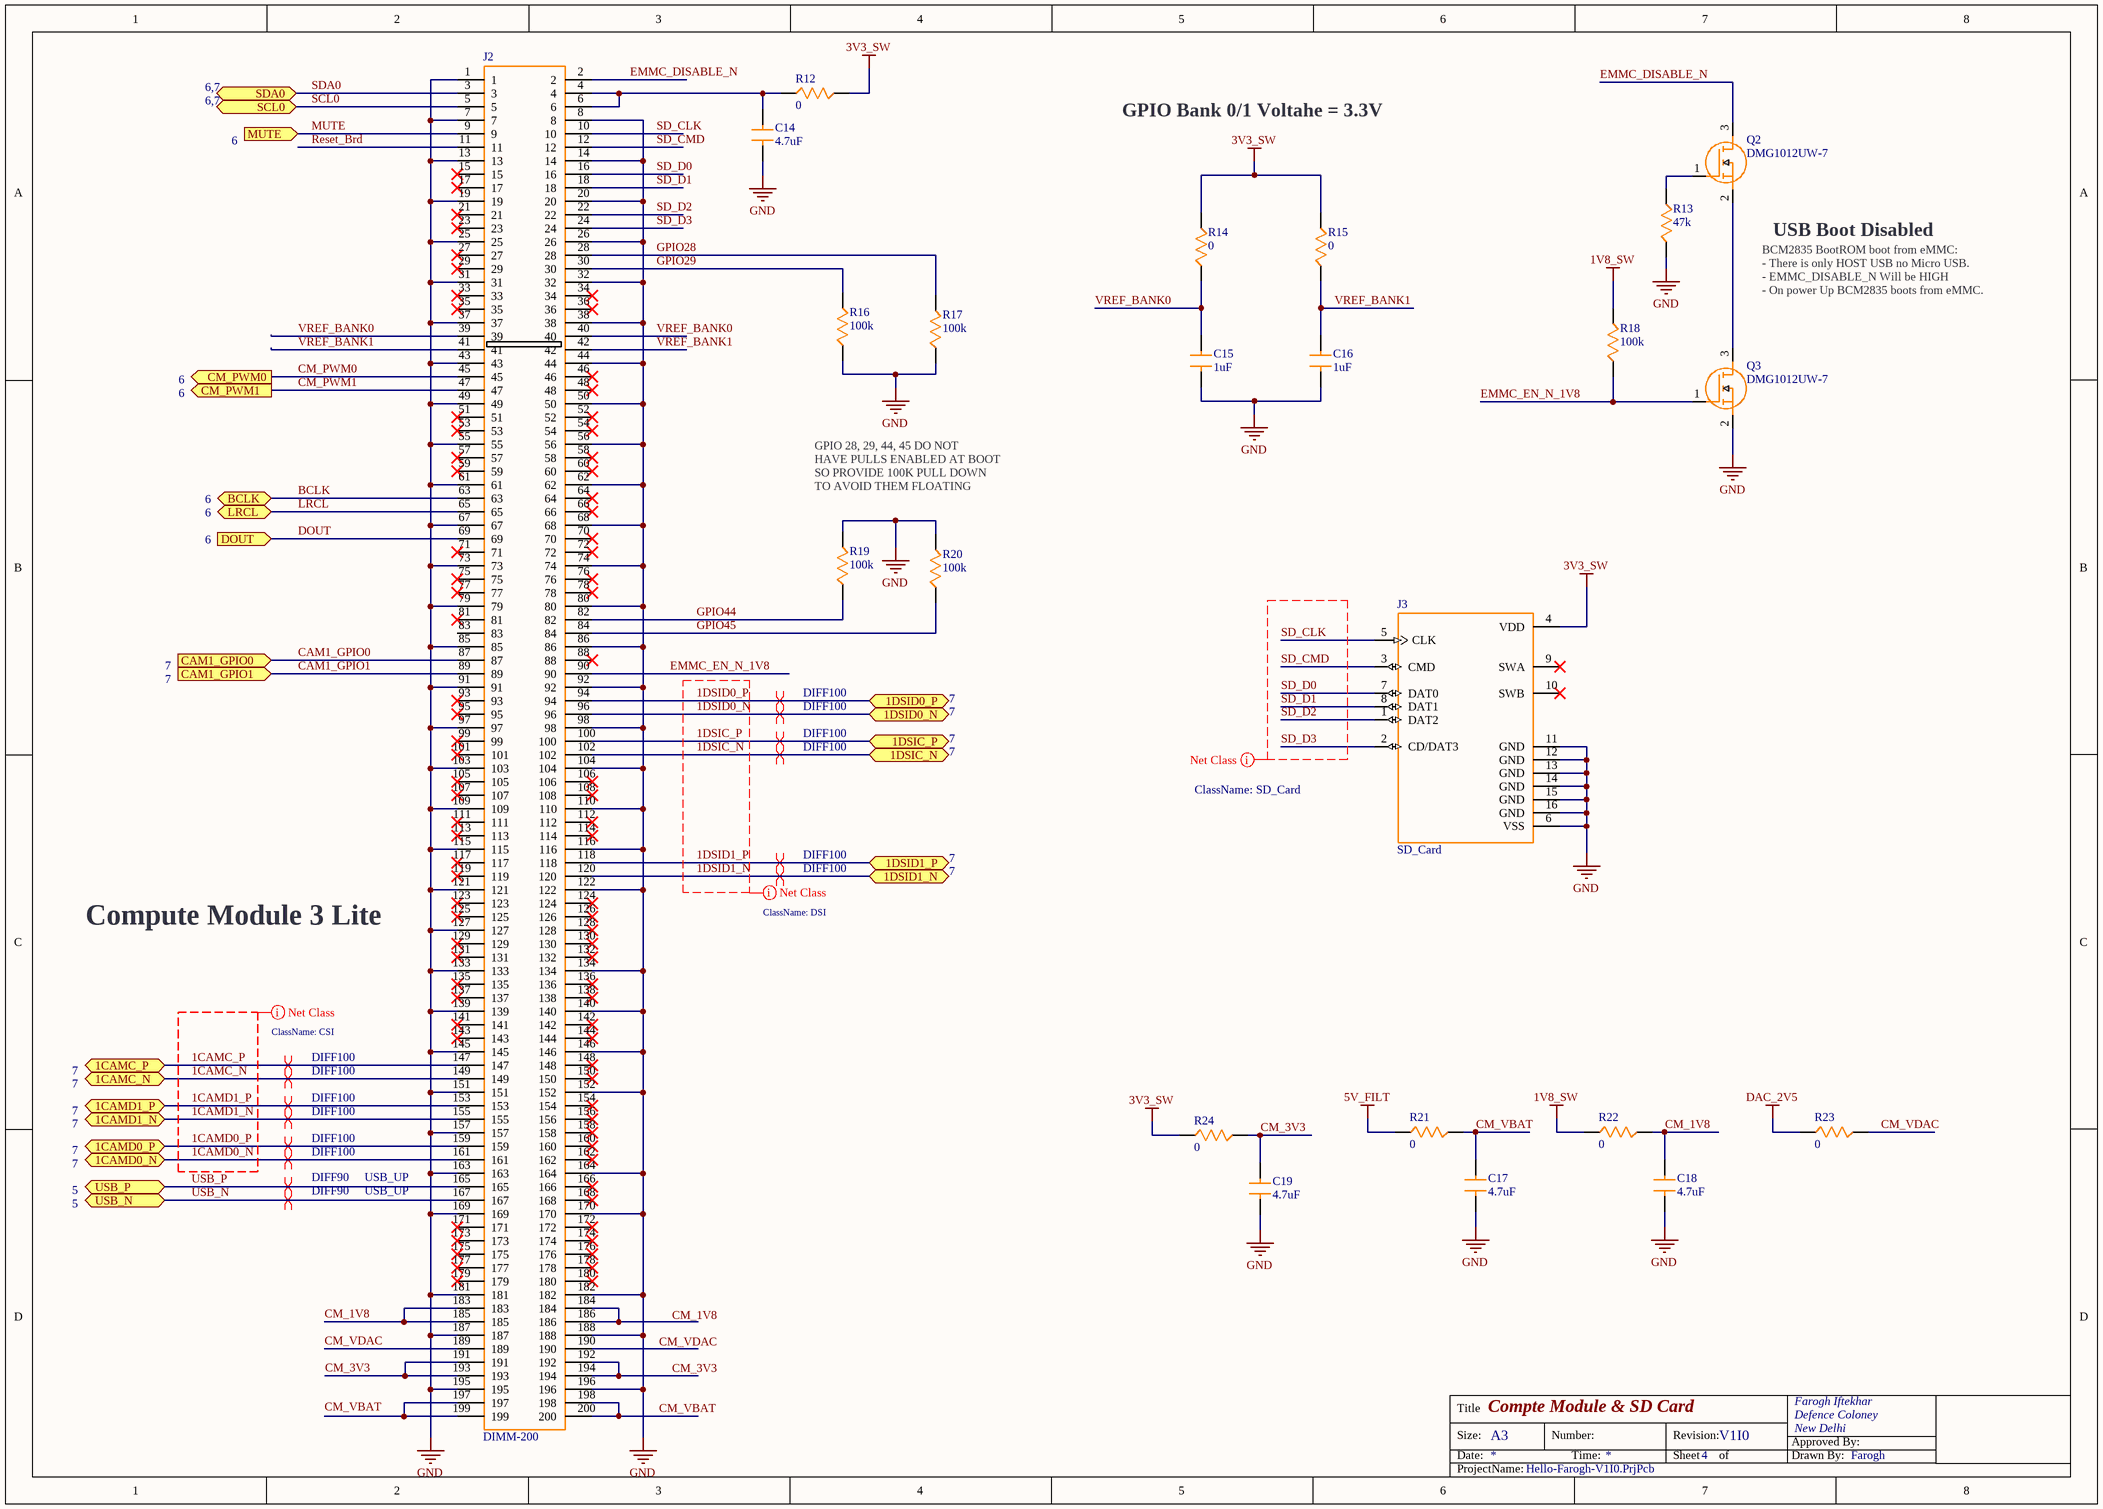
[diagram p3: [04] - Compute Module.SchDoc]

### Parts
C14  4.7uF  [C0805]
C15  1uF  [C0805]
C16  1uF  [C0805]
C17  4.7uF  [C0805]
C18  4.7uF  [C0805]
C19  4.7uF  [C0805]
J2  DIMM-200  [DIMM Connectors-200Pin]
J3  SD_Card  [2201778-1]
Q2  DMG1012UW-7  [DWG1012UW-7]
Q3  DMG1012UW-7  [DWG1012UW-7]
R12  0  [R0805]
R13  47k  [R0805]
R14  0  [R0805]
R15  0  [R0805]
R16  100k  [R0805]
R17  100k  [R0805]
R18  100k  [R0805]
R19  100k  [R0805]
R20  100k  [R0805]
R21  0  [R0805]
R22  0  [R0805]
R23  0  [R0805]
R24  0  [R0805]

### Ports
1CAMC_N (bidir, see 7), 1CAMC_P (bidir, see 7), 1CAMD0_N (bidir, see 7), 1CAMD0_P (bidir, see 7), 1CAMD1_N (bidir, see 7), 1CAMD1_P (bidir, see 7), 1DSIC_N (bidir, see 7), 1DSIC_P (bidir, see 7), 1DSID0_N (bidir, see 7), 1DSID0_P (bidir, see 7), 1DSID1_N (bidir, see 7), 1DSID1_P (bidir, see 7), BCLK (bidir, see 6), CAM1_GPIO0 (in, see 7), CAM1_GPIO1 (in, see 7), CM_PWM0 (out, see 6), CM_PWM1 (out, see 6), DOUT (in, see 6), LRCL (bidir, see 6), MUTE (in, see 6), SCL0 (bidir, see 6,7), SDA0 (see 6,7), USB_N (see 5), USB_P (see 5)

### Nets
1V8_SW: R18.2 R22.1
3V3_SW: J3.4(VDD) R12.2 R14.2 R15.2 R24.1
5V_FILT: R21.1
DAC_2V5: R23.1
GND: C14.1 C15.1 C16.1 C17.1 C18.1 C19.1 J2.1 J2.7 J2.8 J2.13 J2.14 J2.19 J2.20 J2.25 J2.26 J2.31 J2.32 J2.37 J2.38 J2.43 J2.44 J2.49 J2.50 J2.55 J2.56 J2.61 J2.62 J2.67 J2.68 J2.73 J2.74 J2.79 J2.80 J2.85 J2.86 J2.91 J2.92 J2.97 J2.98 J2.103 J2.104 J2.109 J2.110 J2.115 J2.116 J2.121 J2.122 J2.127 J2.133 J2.134 J2.139 J2.140 J2.145 J2.146 J2.151 J2.152 J2.157 J2.163 J2.164 J2.169 J2.170 J2.181 J2.182 J2.187 J2.188 J2.195 J2.196 J3.6(VSS) J3.11(GND) J3.12(GND) J3.13(GND) J3.14(GND) J3.15(GND) J3.16(GND) Q3.2(S) R13.1 R16.1 R17.1 R19.2 R20.2
1CAMC_N: J2.149 ; port 1CAMC_N
1CAMC_P: J2.147 ; port 1CAMC_P
1CAMD0_N: J2.161 ; port 1CAMD0_N
1CAMD0_P: J2.159 ; port 1CAMD0_P
1CAMD1_N: J2.155 ; port 1CAMD1_N
1CAMD1_P: J2.153 ; port 1CAMD1_P
1DSIC_N: J2.102 ; port 1DSIC_N
1DSIC_P: J2.100 ; port 1DSIC_P
1DSID0_N: J2.96 ; port 1DSID0_N
1DSID0_P: J2.94 ; port 1DSID0_P
1DSID1_N: J2.120 ; port 1DSID1_N
1DSID1_P: J2.118 ; port 1DSID1_P
BCLK: J2.63 ; port BCLK
CAM1_GPIO0: J2.87 ; port CAM1_GPIO0
CAM1_GPIO1: J2.89 ; port CAM1_GPIO1
CM_1V8: C18.2 J2.183 J2.185 R22.2
CM_3V3: C19.2 J2.191 J2.192 J2.193 J2.194 R24.2
CM_PWM0: J2.45 ; port CM_PWM0
CM_PWM1: J2.47 ; port CM_PWM1
CM_VBAT: C17.2 J2.198 J2.200 R21.2
CM_VDAC: J2.189 R23.2
DOUT: J2.69 ; port DOUT
EMMC_DISABLE_N: J2.2 Q2.3(D)
EMMC_EN_N_1V8: J2.90 Q3.1(G) R18.1
GPIO28: J2.28 R17.2
GPIO29: J2.30 R16.2
GPIO44: J2.82 R19.1
GPIO45: J2.84 R20.1
LRCL: J2.65 ; port LRCL
MUTE: J2.9 ; port MUTE
Reset_Brd: J2.11
SCL0: J2.5 ; port SCL0
SD_CLK: J2.10 J3.5(CLK)
SD_CMD: J2.12 J3.3(CMD)
SD_D0: J2.16 J3.7(DAT0)
SD_D1: J2.18 J3.8(DAT1)
SD_D2: J2.22 J3.1(DAT2)
SD_D3: J2.24 J3.2(CD/DAT3)
SDA0: J2.3 ; port SDA0
USB_N: J2.167 ; port USB_N
USB_P: J2.165 ; port USB_P
VREF_BANK0: C15.2 J2.39 J2.40 R14.1
VREF_BANK1: C16.2 J2.41 J2.42 R15.1
NetC14_2: C14.2 J2.4 J2.6 R12.1
NetJ2_184: J2.184 J2.186
NetJ2_197: J2.197 J2.199
NetQ2_1: Q2.1(G) R13.2
NetQ2_2: Q2.2(S) Q3.3(D)

Not connected (* = marked no-connect by the designer): J2 15* 17* 21* 23* 27* 29* 33* 34* 35* 36* 46* 48* 51* 52* 53* 54* 57* 58* 59* 60* 64* 66* 70* 71* 72* 75* 76* 77* 78* 81* 83 88* 93* 95* 99* 101* 105* 106* 107* 108* 111* 112* 113* 114* 117* 119* 123* 124* 125* 126* 128* 129* 130* 131* 132* 135* 136* 137* 138* 141* 142* 143* 144* 148* 150* 154* 156* 158* 160* 162* 166* 168* 171* 172* 173* 174* 175* 176* 177* 178* 179* 180* 190; J3 9(SWA)* 10(SWB)*

### Layout directives
differential pair; net class DIFF100: 1CAMC_N, 1CAMC_P, 1CAMD0_N, 1CAMD0_P, 1CAMD1_N, 1CAMD1_P, 1DSIC_N, 1DSIC_P, 1DSID0_N, 1DSID0_P, 1DSID1_N, 1DSID1_P
net class CSI: 1CAMC_N, 1CAMC_P, 1CAMD0_N, 1CAMD0_P, 1CAMD1_N, 1CAMD1_P
differential pair; net class DIFF90; net class USB_UP: USB_N, USB_P
net class DSI: 1DSIC_N, 1DSIC_P, 1DSID0_N, 1DSID0_P, 1DSID1_N, 1DSID1_P
net class SD_Card: SD_CLK, SD_CMD, SD_D0, SD_D1, SD_D2, SD_D3

### Notes on the sheet
- GPIO Bank 0/1 Voltahe = 3.3V
- (near Q2) USB Boot Disabled
- BCM2835 BootROM boot from eMMC:
- - There is only HOST USB no Micro USB.
- - EMMC_DISABLE_N Will be HIGH
- - On power Up BCM2835 boots from eMMC.
- GPIO 28, 29, 44, 45 DO NOT
- HAVE PULLS ENABLED AT BOOT
- SO PROVIDE 100K PULL DOWN
- TO AVOID THEM FLOATING
- Compute Module 3 Lite
- Labels drawn without touching a wire or pin: CM_1V8, CM_VBAT, CM_VDAC
- Title
- Size:
- Date:
- A3
- Number:
- Time:
- Revision:
- Sheet
- of
- Approved By:
- Drawn By:
- ProjectName:

### Library data of the parts
C14 C17-C19 = C_0805-4.7uF: Multilayer Ceramic Capacitors MLCC - SMD/SMT FACTORY NOT ACCEPTING ORDERS; Manufacturer: KEMET; Manufacturer Part Number: C0805X475K4RACAUTO; Tolerance: 10 %; Type: X7R Dielectric; Voltage Rating DC: 16 VDC; Capacitance - nF: 4700 nF; Class: Class 2; Dielectric: X7R; Qualification: AEC-Q200; Product Status: New Product; Supplier 1: Mouser; RoHS: RoHS Compliant; Category: Multilayer Ceramic Capacitors MLCC - SMD/SMT; Stock 1: 4312; Pricing 1: 1=0.860, 10=0.582, 100=0.363, 500=0.328, 1000=0.300, 2500=0.196, 10000=0.186, 25000=0.182, 50000=0.175 (USD); Capacitance: 4.7 uF; Height: 1.25 mm; Length: 2 mm; Package / Case: 0805 (2012 metric); Packaging: Reel; Product: Automotive MLCCs; Series: SMD Auto X7R Flex; Termination Style: SMD/SMT; Width: 1.25 mm; Brand: KEMET; Case Code - in: 0805; Case Code - mm: 2012; Maximum Operating Temperature: + 125 C; Minimum Operating Temperature: - 55 C; Product Type: Ceramic Capacitors; Standard Pack Qty: 2500; Subcategory: Capacitors; Termination: Flexible (Soft); Tradename: FT-CAP; RoHS - Mouser: Y; Minimum Order Quantity: 2500; Reeling: True; ComponentLink1URL: https://www.mouser.com/datasheet/2/212/KEM_C1078_X7R_FT-CAP_AUTO_SMD-1103315.pdf; ComponentLink1Description: https://www.mouser.com/datasheet/2/212/KEM_C1078_X7R_FT-CAP_AUTO_SMD-1103315.pdf; Supplier Part Number 1: 80-C0805X475K4RAUTO
C15 C16 = C_0805-1uF: Multilayer Ceramic Capacitors MLCC - SMD/SMT 10V 1uF X7R 0805 10%; Manufacturer: KEMET; Manufacturer Part Number: C0805C105K8RAC7210; Voltage Rating DC: 10 VDC; Capacitance - nF: 1000 nF; Class: Class 2; Product Status: New Product; Supplier 1: Mouser; RoHS: RoHS Compliant; Category: Multilayer Ceramic Capacitors MLCC - SMD/SMT; Stock 1: 38596; Pricing 1: 1=0.230, 10=0.104, 100=0.064, 500=0.057, 1000=0.048, 2000=0.041, 10000=0.036, 15000=0.032, 45000=0.028 (USD); Capacitance: 1 uF; Height: 0.9 mm; Length: 2 mm; Package / Case: 0805 (2012 metric); Packaging: Cut Tape; Product: General Type MLCCs; Series: SMD Comm X7R; Termination Style: SMD/SMT; Tolerance: 10 %; Width: 1.25 mm; Brand: KEMET; Case Code - in: 0805; Case Code - mm: 2012; Dielectric: X7R; Maximum Operating Temperature: + 125 C; Minimum Operating Temperature: - 55 C; Product Type: Ceramic Capacitors; Standard Pack Qty: 15000; Subcategory: Capacitors; Termination: Standard; RoHS - Mouser: Y; Minimum Order Quantity: 1; Reeling: True; ComponentLink1URL: https://www.mouser.com/datasheet/2/212/KEM_C1002_X7R_SMD-1102033.pdf; ComponentLink1Description: https://www.mouser.com/datasheet/2/212/KEM_C1002_X7R_SMD-1102033.pdf; Supplier Part Number 1: 80-C0805C105K8R7210
J2 = TE_DIMM, 0.6MM: DIMM Connectors .6MM 200D R/SM 1.8V DIMMSO DDR; Manufacturer: TE Connectivity / AMP; Manufacturer Part Number: 1473149-4; Mounting Angle: Right; Number of Positions: 200 Position; Pitch: 0.6 mm; Supplier 1: Mouser; RoHS: RoHS Compliant; Category: DIMM Connectors; Stock 1: 8127; Pricing 1: 1=2.45, 50=2.26, 100=2.10 (USD); Contact Plating: Gold; Height: 5.2 mm; Housing Material: Thermoplastic (TP); Packaging: Tray; Product: SODIMM; Termination Style: SMD/SMT; Type: DDR2; Voltage Rating: 1.8 V; Brand: TE Connectivity / AMP; Contact Material: Copper Alloy; Product Type: DIMM Connectors; Standard Pack Qty: 20; Subcategory: Memory Connectors & Sockets; RoHS - Mouser: Y; Minimum Order Quantity: 1; Reeling: False; ComponentLink1URL: https://www.mouser.com/datasheet/2/418/NG_CD_1473149_K3-1239525.pdf; ComponentLink1Description: https://www.mouser.com/datasheet/2/418/NG_CD_1473149_K3-1239525.pdf; Supplier Part Number 1: 571-1473149-4
J3 = SD-Card Slot: Memory Card Connectors MICRO SD PUSH LOW PROFILE TYPE; Manufacturer: TE Connectivity; Card Type: SIM; CNHTS: 8538900000; MXHTS: 85366999; TARIC: 8536909599; Supplier 1: Mouser; Manufacturer Part Number: 2201778-1; RoHS: RoHS Compliant; Category: Memory Card Connectors; Stock 1: 4643; Pricing 1: 1=2.57, 10=2.16, 100=1.80, 500=1.75, 1000=1.41 (USD); Contact Plating: Gold; Housing Material: Thermoplastic (TP); Packaging: Cut Tape; Series: DYNAMIC; Termination Style: SMD/SMT; Brand: TE Connectivity; Contact Material: Copper Alloy; HTS Code: 8536694040; Product Type: Memory Card Connectors; Standard Pack Qty: 1000; Subcategory: Memory Connectors & Sockets; RoHS - Mouser: Y; Minimum Order Quantity: 1; Reeling: True; ComponentLink1URL: http://www.mouser.com/datasheet/2/418/PN_CD_2201778_B-1150756.pdf; ComponentLink1Description: http://www.mouser.com/datasheet/2/418/PN_CD_2201778_B-1150756.pdf; Supplier Part Number 1: 571-2201778-1
Q2 Q3 = DMG1012UW-7 (2): MOSFET MOSFET N-CHANNEL SOT-323; Manufacturer: Diodes Incorporated; Configuration: Single; Transistor Type: 1 N-Channel; Number of Channels: 1 Channel; Channel Mode: Enhancement; CNHTS: 8541210000; Fall Time: 12.3 ns; Id - Continuous Drain Current: 1 A; MXHTS: 85412101; Pd - Power Dissipation: 290 mW; Qg - Gate Charge: 736.6 pC; Rds On - Drain-Source Resistance: 450 mOhms; Rise Time: 7.4 ns; Typical Turn-Off Delay Time: 26.7 ns; Typical Turn-On Delay Time: 5.1 ns; Vds - Drain-Source Breakdown Voltage: 20 V; Vgs - Gate-Source Voltage: 4.5 V; Vgs th - Gate-Source Threshold Voltage: 500 mV; Supplier 1: Mouser; Manufacturer Part Number: DMG1012UW-7; RoHS: RoHS Compliant; Category: MOSFET; Stock 1: 210682; Pricing 1: 1=0.330, 10=0.225, 100=0.094, 1000=0.064, 3000=0.050, 9000=0.043, 24000=0.040, 45000=0.038 (USD); Package / Case: SOT-323-3; Packaging: Cut Tape; Product: MOSFET Small Signal; Series: DMG1012; Technology: Si; Brand: Diodes Incorporated; Mounting Style: SMD/SMT; Transistor Polarity: N-Channel; HTS Code: 8541210095; Maximum Operating Temperature: + 150 C; Minimum Operating Temperature: - 55 C; Product Type: MOSFET; Standard Pack Qty: 3000; Subcategory: MOSFETs; TARIC: 8541210000; RoHS - Mouser: Y; Minimum Order Quantity: 1; Reeling: True; ComponentLink1URL: http://www.mouser.com/datasheet/2/115/ds31859-90313.pdf; ComponentLink1Description: http://www.mouser.com/datasheet/2/115/ds31859-90313.pdf; Supplier Part Number 1: 621-DMG1012UW-7
R12 R14 R15 R21-R24 = R_0805-0: as R3 on sheet [03] - Power Supply; Supplier 1: Mouser; RoHS: RoHS Compliant; Category: Current Sense Resistors - SMD; Stock 1: 3927; Pricing 1: 1=1.30, 10=1.06, 100=0.706, 500=0.595, 1000=0.495, 5000=0.431, 10000=0.421, 25000=0.409 (USD); Application: Current Sense; Length: 2.03 mm; Packaging: Cut Tape; Product: Current Sense Chip Resistor Surface Mount; Series: PA_L; Technology: Metal Element; Termination Style: SMD/SMT; Tolerance: -; Type: Low TCR Current Sense Resistor; Width: 1.27 mm; Brand: Yageo; Mounting Style: PCB Mount; Case Code - in: 0805; Case Code - mm: 2012; HTS Code: 8533210030; Maximum Operating Temperature: + 155 C; Minimum Operating Temperature: - 55 C; Product Type: Current Sense Resistors; Standard Pack Qty: 5000; Subcategory: Resistors; Termination: 2 Terminal; RoHS - Mouser: Y; Minimum Order Quantity: 1; Reeling: True; ComponentLink1URL: http://www.mouser.com/datasheet/2/447/PYu-PA0805_L_51_RoHS_0-1480254.pdf; ComponentLink1Description: http://www.mouser.com/datasheet/2/447/PYu-PA0805_L_51_RoHS_0-1480254.pdf; Supplier Part Number 1: 603-PA0805-R-470RL
R13 = R_0805-47K: Thin Film Resistors - SMD; Manufacturer: Yageo; Manufacturer Part Number: RT0805DRD0747KL; Power Rating: 125 mW (1/8 W); Resistance: 47 kOhms; Temperature Coefficient: 25 PPM / C; Tolerance: 0.5 %; Voltage Rating: 150 V; CNHTS: 8533211000; MXHTS: 85332101; TARIC: 8533210000; Supplier 1: Mouser; RoHS: RoHS Compliant; Category: Thin Film Resistors - SMD; Stock 1: 9318; Pricing 1: 1=0.270, 10=0.162, 100=0.053, 1000=0.037, 5000=0.028, 10000=0.026, 25000=0.025, 50000=0.024 (USD); Features: -; Height: 0.5 mm; Length: 2 mm; Operating Temperature Range: - 55 C to + 125 C; Package / Case: 0805 (2012 metric); Packaging: Cut Tape; Product: Thin Film Resistors SMD; Series: RT; Termination Style: SMD/SMT; Type: High Precision, High Stability; Width: 1.25 mm; Brand: Yageo; Case Code - in: 0805; Case Code - mm: 2012; HTS Code: 8533210030; Maximum Operating Temperature: + 125 C; Minimum Operating Temperature: - 55 C; Product Type: Thin Film Resistors; Standard Pack Qty: 5000; Subcategory: Resistors; RoHS - Mouser: Y; Minimum Order Quantity: 1; Reeling: True; ComponentLink1URL: http://www.mouser.com/datasheet/2/447/PYu-RT_1-to-0.01_RoHS_L_9-1222720.pdf; ComponentLink1Description: http://www.mouser.com/datasheet/2/447/PYu-RT_1-to-0.01_RoHS_L_9-1222720.pdf; Supplier Part Number 1: 603-RT0805DRD0747KL
R16-R20 = R_0805-100K: as R4 on sheet [03] - Power Supply; Supplier 1: Mouser; Category: Thick Film Resistors - SMD; Stock 1: 38013; Pricing 1: 1=0.160, 10=0.037, 100=0.013, 1000=0.010, 2500=0.006, 20000=0.005 (USD); Application: Automotive Grade; Features: -; Height: 0.5 mm; Length: 2 mm; Package / Case: 0805 (2012 metric); Packaging: Cut Tape; Product: Thick Film Resistors SMD; Series: AC; Technology: Thick Film; Termination Style: SMD/SMT; Tolerance: 1 %; Voltage Rating: 150 V; Width: 1.25 mm; Brand: Yageo; Mounting Style: PCB Mount; Case Code - in: 0805; Case Code - mm: 2012; HTS Code: 8533210030; Maximum Operating Temperature: + 155 C; Minimum Operating Temperature: - 55 C; Product Type: Thick Film Resistors; Standard Pack Qty: 20000; Subcategory: Resistors; Minimum Order Quantity: 1; Reeling: True; ComponentLink1URL: http://www.mouser.com/datasheet/2/447/PYu-AC_51_RoHS_L_6-1152827.pdf; ComponentLink1Description: http://www.mouser.com/datasheet/2/447/PYu-AC_51_RoHS_L_6-1152827.pdf; Supplier Part Number 1: 603-AC0805FR-13100KL